# EAGLE design bonnet_floral (EAGLE 7.7.0)
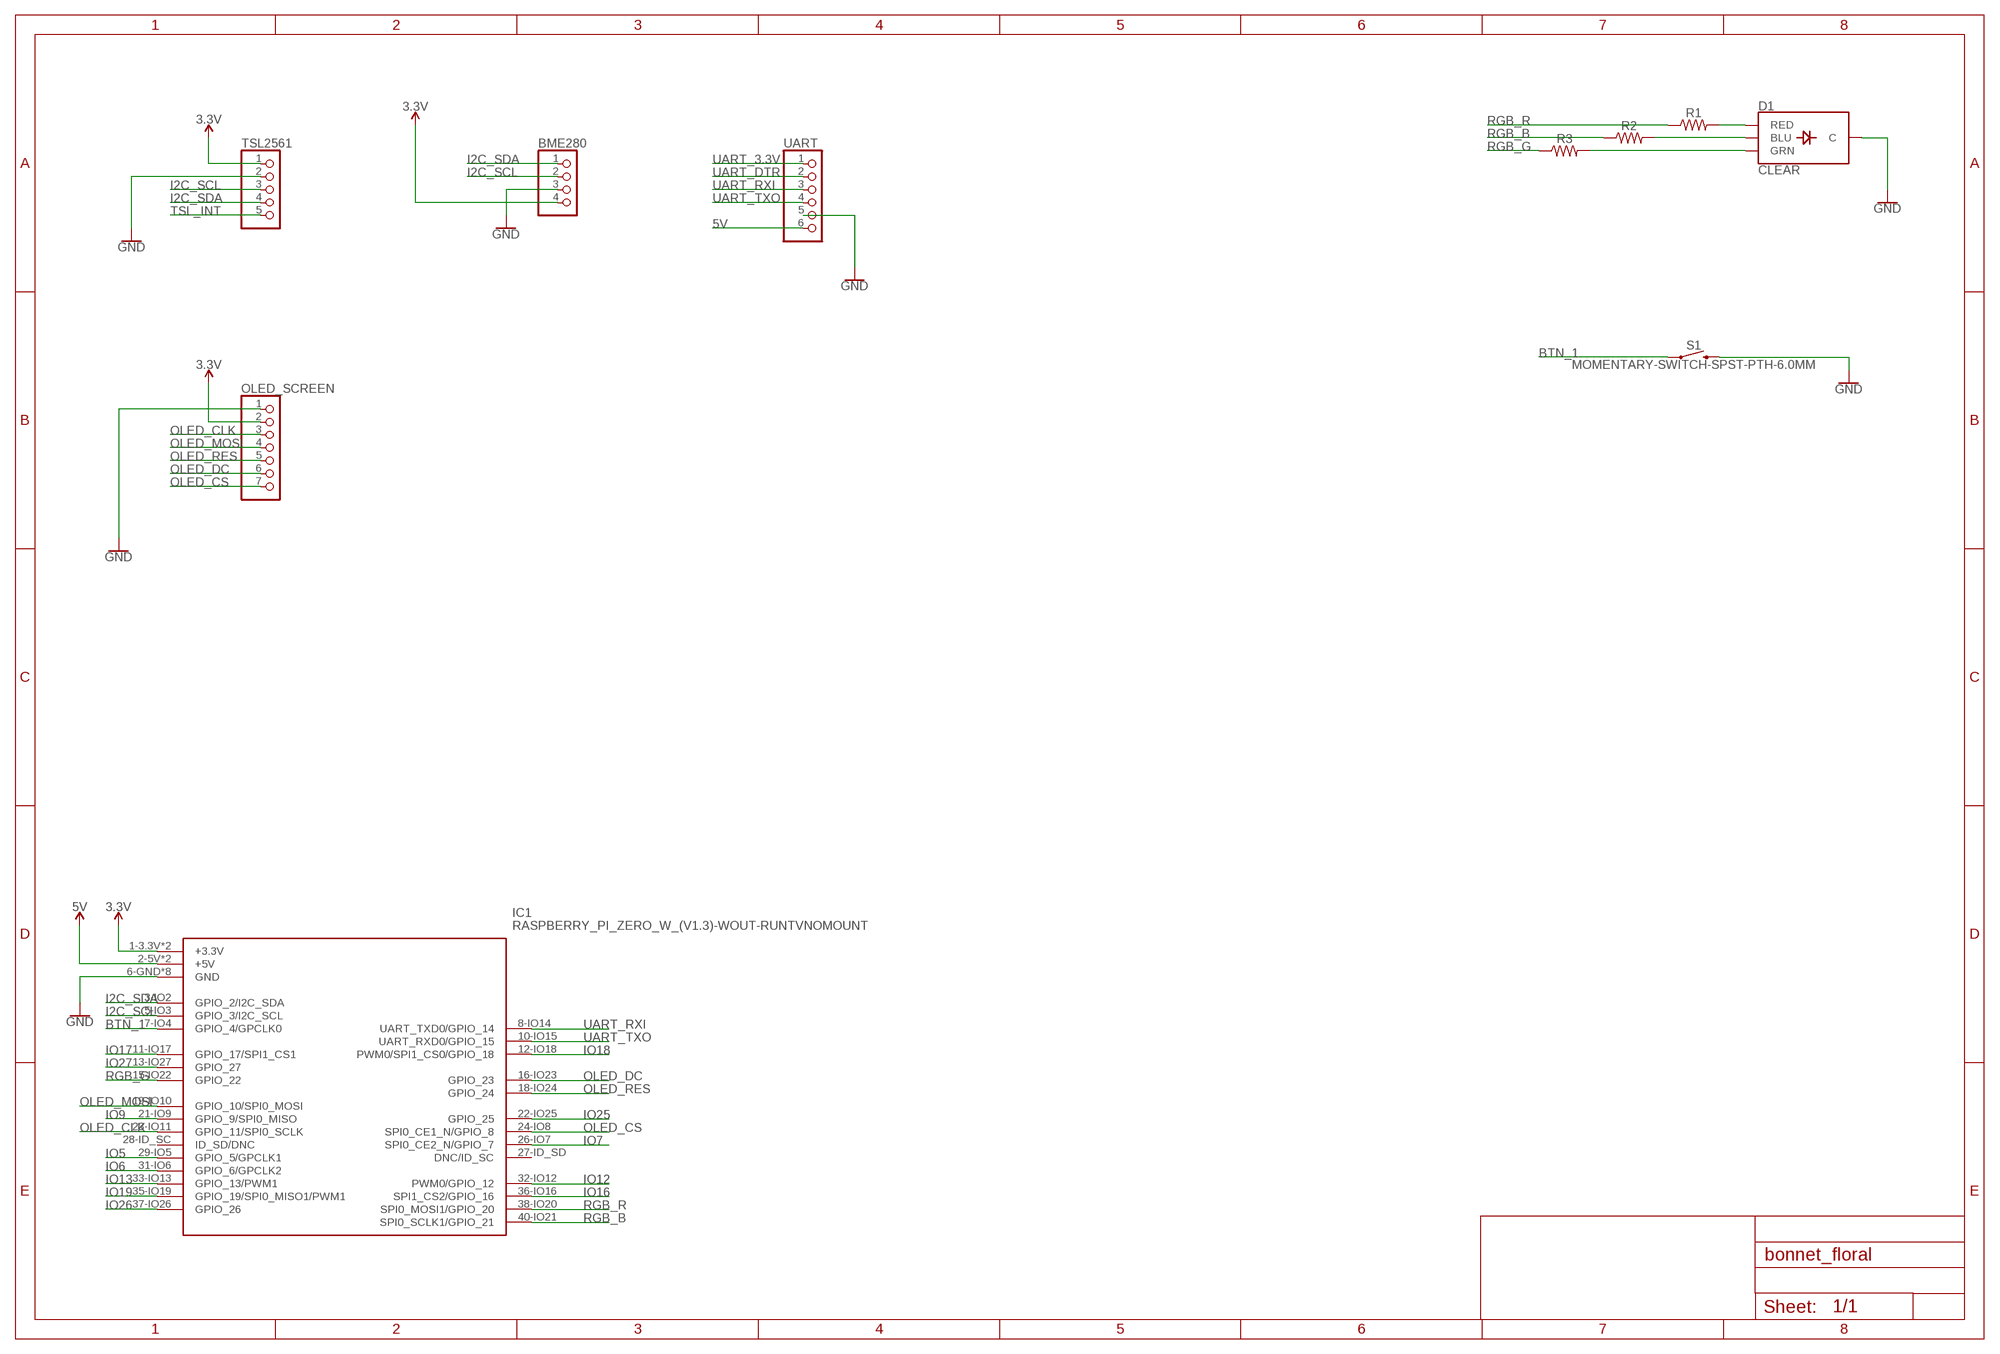
[diagram p0: schematic, sheet 1]

## Parts
BME280  PINHD-1X4  [1X04]
D1  CLEAR  LED-RGB-CCCLEAR  [LED-RGB-THRU@1]
IC1  RASPBERRY_PI_ZERO_W_(V1.3)-WOUT-RUNTVNOMOUNT  [RASPBERRYPIZEROWV13-WOUT-RUNTV-NOMOUNT]
OLED_SCREEN  PINHD-1X7  [1X07]
R1  RESISTORAXIAL-0.3  [AXIAL-0.3]
R2  RESISTORAXIAL-0.3  [AXIAL-0.3]
R3  RESISTORAXIAL-0.3  [AXIAL-0.3]
S1  MOMENTARY-SWITCH-SPST-PTH-6.0MM  [TACTILE_SWITCH_PTH_6.0MM]
TSL2561  PINHD-1X5  [1X05]
UART  PINHD-1X6  [1X06]

## Nets
3.3V: BME280.4 IC1.1-3.3V(+3.3V) IC1.17-3.3V(+3.3V) OLED_SCREEN.2 TSL2561.1
5V: IC1.2-5V(+5V) IC1.4-5V(+5V) UART.6
BTN_1: IC1.7-IO4(GPIO_4/GPCLK0) S1.1
GND: BME280.3 D1.2(C) IC1.6-GND(GND) IC1.9-GND(GND) IC1.14-GND(GND) IC1.20-GND(GND) IC1.25-GND(GND) IC1.30-GND(GND) IC1.34-GND(GND) IC1.39-GND(GND) OLED_SCREEN.1 S1.3 TSL2561.2 UART.5
I2C_SCL: BME280.2 IC1.5-IO3(GPIO_3/I2C_SCL) TSL2561.3
I2C_SDA: BME280.1 IC1.3-IO2(GPIO_2/I2C_SDA) TSL2561.4
IO5: IC1.29-IO5(GPIO_5/GPCLK1)
IO6: IC1.31-IO6(GPIO_6/GPCLK2)
IO7: IC1.26-IO7(SPI0_CE2_N/GPIO_7)
IO9: IC1.21-IO9(GPIO_9/SPI0_MISO)
IO12: IC1.32-IO12(PWM0/GPIO_12)
IO13: IC1.33-IO13(GPIO_13/PWM1)
IO16: IC1.36-IO16(SPI1_CS2/GPIO_16)
IO17: IC1.11-IO17(GPIO_17/SPI1_CS1)
IO18: IC1.12-IO18(PWM0/SPI1_CS0/GPIO_18)
IO19: IC1.35-IO19(GPIO_19/SPI0_MISO1/PWM1)
IO25: IC1.22-IO25(GPIO_25)
IO26: IC1.37-IO26(GPIO_26)
IO27: IC1.13-IO27(GPIO_27)
N$1: D1.1(RED) R1.P$2
N$2: D1.4(BLU) R2.P$2
N$3: D1.3(GRN) R3.P$2
OLED_CLK: IC1.23-IO11(GPIO_11/SPI0_SCLK) OLED_SCREEN.3
OLED_CS: IC1.24-IO8(SPI0_CE1_N/GPIO_8) OLED_SCREEN.7
OLED_DC: IC1.16-IO23(GPIO_23) OLED_SCREEN.6
OLED_MOSI: IC1.19-IO10(GPIO_10/SPI0_MOSI) OLED_SCREEN.4
OLED_RES: IC1.18-IO24(GPIO_24) OLED_SCREEN.5
RGB_B: IC1.40-IO21(SPI0_SCLK1/GPIO_21) R2.P$1
RGB_G: IC1.15-IO22(GPIO_22) R3.P$1
RGB_R: IC1.38-IO20(SPI0_MOSI1/GPIO_20) R1.P$1
TSL_INT: TSL2561.5
UART_3.3V: UART.1
UART_DTR: UART.2
UART_RXI: IC1.8-IO14(UART_TXD0/GPIO_14) UART.3
UART_TXO: IC1.10-IO15(UART_RXD0/GPIO_15) UART.4
Unconnected: IC1.27-ID_SD(DNC/ID_SC) IC1.28-ID_SC(ID_SD/DNC)

## Library data of the parts
BME280 = pinhead:PINHD-1X4: PIN HEADER
D1 = SparkFun-LED:LED-RGB-CC: LED-RGB Common Cathode Packages: LED RGB-THRU LED_PIRANHA_5MM SparkFun Products: RGB Diffused Common Cathode- Diffuse <[https://www.sparkfun.com/products/9264]> RGB Diffused Common Cathode - Clear <[https://www.sparkfun.com/products/105]> LED-RGB 5mm Square (Piranha) <[https://www.sparkfun.com/products/11679]>; PROD_ID: DIO-08418
IC1 = Raspberry_Pi_Zero_W_(v1.3):RASPBERRY_PI_ZERO_W_(V1.3)-WOUT-RUNTV: Raspberry Pi Zero W (v1.3) Single-board Computers Source: Datasheet <https://cdn.sparkfun.com/assets/learn_tutorials/6/7/6/PiZero_1.pdf>
OLED_SCREEN = pinhead:PINHD-1X7: PIN HEADER
R1-R3 = SparkFun-Resistors:RESISTOR: Generic Resistor Package
S1 = SparkFun-Switches:MOMENTARY-SWITCH-SPST: Momentary Switch (Pushbutton) - SPST Normally-open (NO) SPST momentary switches (buttons, pushbuttons). Variants PTH-12MM - 12mm square, through-hole Momentary Pushbutton Switch - 12mm Square <https://www.sparkfun.com/products/9190> (COM-09190) PTH-6.0MM, PTH-6.0MM-KIT - 6.0mm square, through-hole Mini Pushbutton Switch <https://www.sparkfun.com/products/97> (COM-00097) KIT package intended for soldering kit's - only one side of pads' copper is exposed. PTH-RIGHT-ANGLE-KIT - Right-angle, through-hole Right Angle Tactile Button <https://www.sparkfun.com/products/10791> - Used on SparkFun BigTime Watch Kit <https://www.sparkfun.com/products/11734> SMD-12MM - 12mm square, surface-mount Tactile Button - SMD (12mm) <https://www.sparkfun.com/products/12993> (COM-12993) Used on SparkFun PicoBoard <https://www.sparkfun.com/products/11888> SMD-4.5MM - 4.5mm Square Trackball Switch Used on SparkFun Blackberry Trackballer Breakout <https://www.sparkfun.com/products/13169> SMD-4.6MMX2.8MM - 4.60mm x 2.80mm, surface mount Used on SparkFun SAMD21 Mini Breakout <https://www.sparkfun.com/products/13664> SMD-5.2MM, SMD-5.2-REDUNDANT - 5.2mm square, surface-mount Mini Pushbutton Switch - SMD <https://www.sparkfun.com/products/8720> (COM-08720) Used on Arduino Pro Mini <https://www.sparkfun.com/products/11114> REDUNDANT package connects both switch circuits together SMD-6.0X3.5MM - 6.0 x 3.5mm, surface mount Momentary Reset Switch SMD <https://www.sparkfun.com/products/8229> (COM-08229) SMD-6.2MM-TALL - 6.2mm square, surface mount Tactile Button - SMD (6mm) <https://www.sparkfun.com/products/12992> Used on SparkFun Digital Sandbox <https://www.sparkfun.com/products/12651> SMD-RIGHT-ANGLE - Right-angle, surface mount Used on SparkFun Block for Intel® Edison - Arduino <https://www.sparkfun.com/products/13036>; PROD_ID: SWCH-08441; SF_SKU: COM-00097
TSL2561 = pinhead:PINHD-1X5: PIN HEADER
UART = pinhead:PINHD-1X6: PIN HEADER

## Board
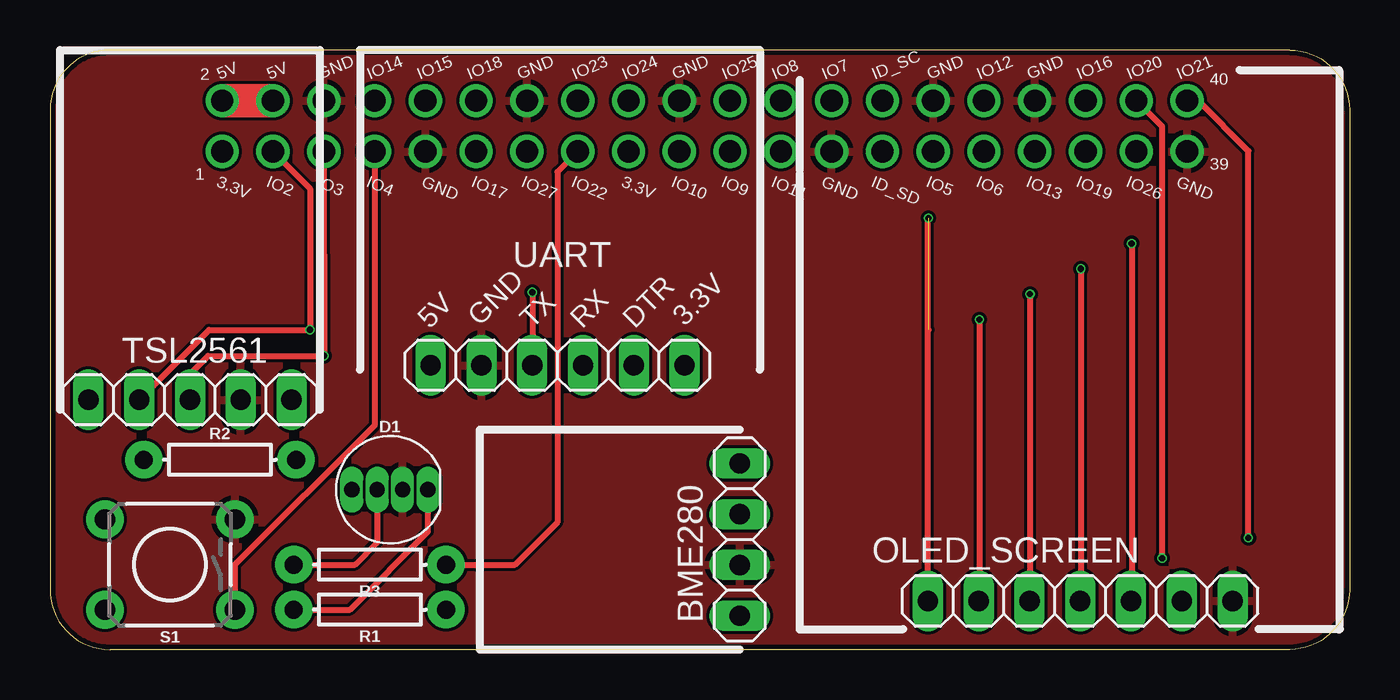
[diagram p1: board, top side]
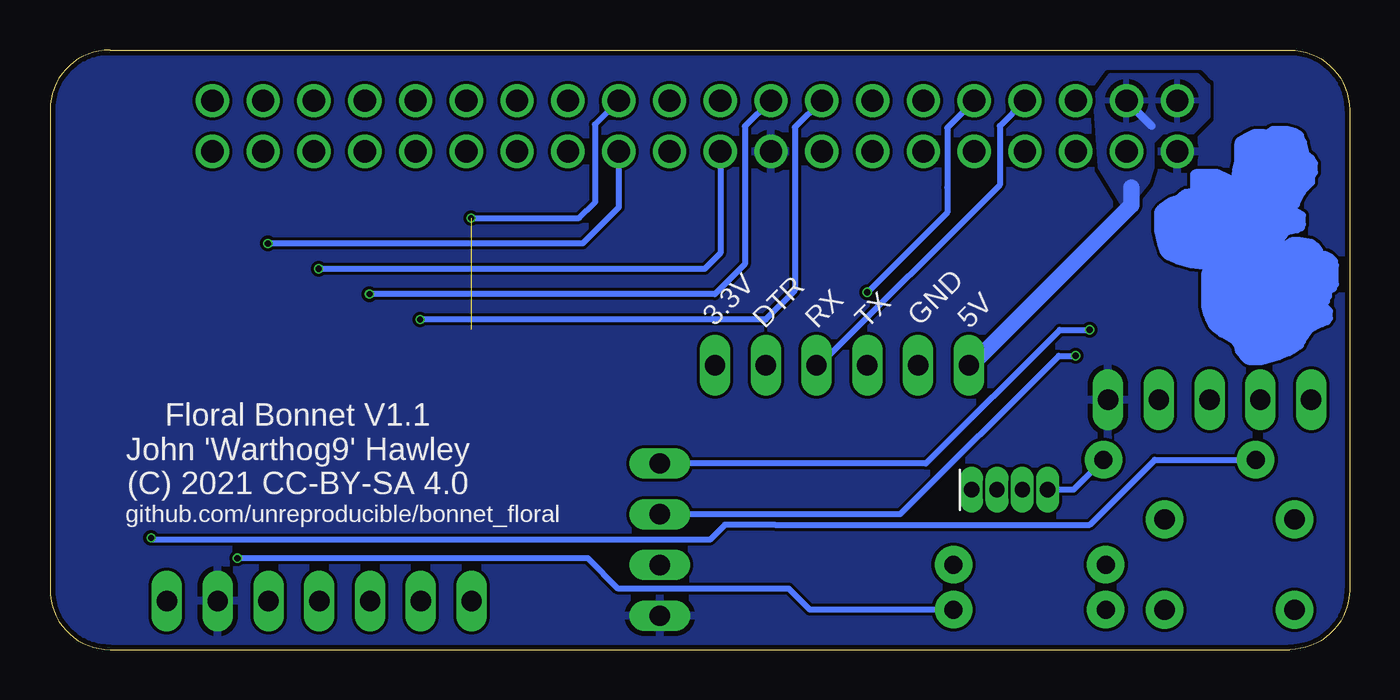
[diagram p2: board, bottom side, seen from below]

Size 65 x 30 mm. Coordinates in mm from the lower left corner, seen from the top.
Copper layers (1*16): Top 0.035mm / dielectric 1.5mm / Bottom 0.035mm
Design rules "default *": minimum track width 6mil, minimum drill 12mil, track to track 6mil, track to pad 6mil, pad to pad 6mil, via to via 6mil, smd to smd 6mil, copper to edge 10mil, drill to drill 8mil, minimum pad ring 0mil, minimum via ring 0mil, stop-mask expansion 4mil, vias tented up to drill 0mil, thermal gap 10mil

### Footprints (pad centres in the part's own frame; a part is rotated, then mirrored left to right if it is on the bottom)
1X04 = drill 1.016 long: 1 -3.81,0; 2 -1.27,0; 3 1.27,0; 4 3.81,0
LED-RGB-THRU@1 = drill 0.762 pad 0.889 long: 1 1.905,0; 2 0.635,0; 3 -0.635,0; 4 -1.905,0
RASPBERRYPIZEROWV13-WOUT-RUNTV-NOMOUNT = drill 1.11: 1-3.3V 8.615,24.92; 2-5V 8.615,27.46; 3-IO2 11.155,24.92; 4-5V 11.155,27.46; 5-IO3 13.695,24.92; 6-GND 13.695,27.46; 7-IO4 16.235,24.92; 8-IO14 16.235,27.46; 9-GND 18.775,24.92; 10-IO15 18.775,27.46; 11-IO17 21.315,24.92; 12-IO18 21.315,27.46; 13-IO27 23.855,24.92; 14-GND 23.855,27.46; 15-IO22 26.395,24.92; 16-IO23 26.395,27.46; 17-3.3V 28.935,24.92; 18-IO24 28.935,27.46; 19-IO10 31.475,24.92; 20-GND 31.475,27.46; 21-IO9 34.015,24.92; 22-IO25 34.015,27.46; 23-IO11 36.555,24.92; 24-IO8 36.555,27.46; 25-GND 39.095,24.92; 26-IO7 39.095,27.46; 27-ID_SD 41.635,24.92; 28-ID_SC 41.635,27.46; 29-IO5 44.175,24.92; 30-GND 44.175,27.46; 31-IO6 46.715,24.92; 32-IO12 46.715,27.46; 33-IO13 49.255,24.92; 34-GND 49.255,27.46; 35-IO19 51.795,24.92; 36-IO16 51.795,27.46; 37-IO26 54.335,24.92; 38-IO20 54.335,27.46; 39-GND 56.875,24.92; 40-IO21 56.875,27.46
1X07 = drill 1.016 long: 1 -7.62,0; 2 -5.08,0; 3 -2.54,0; 4 0,0; 5 2.54,0; 6 5.08,0; 7 7.62,0
AXIAL-0.3 = drill 0.9 pad 1.88: P$1 -3.81,0; P$2 3.81,0
TACTILE_SWITCH_PTH_6.0MM = drill 1.016 pad 1.88: 1 -3.251,2.261; 2 3.251,2.261; 3 -3.251,-2.261; 4 3.251,-2.261
1X05 = drill 1.016 long: 1 -5.08,0; 2 -2.54,0; 3 0,0; 4 2.54,0; 5 5.08,0
1X06 = drill 1.016 long: 1 -6.35,0; 2 -3.81,0; 3 -1.27,0; 4 1.27,0; 5 3.81,0; 6 6.35,0

### Placement (x,y rotation side)
BME280  34.5,5.5 270 top
D1  17,8 0 top
IC1  0,0 0 top
OLED_SCREEN  51.53,2.43 180 top
R1  16,2 180 top
R2  8.5,9.5 0 top
R3  16,4.25 180 top
S1  6,4.25 180 top
TSL2561  7,12.5 180 top
U$1  [FLORAL_SMALLER_MIRROR]  5.13,20.23 0 bottom
UART  25.39,14.22 180 top

### Tracks (layer width: path | path; a pad name or v marks a point on that pad's centre or on a via)
3.3V
  pour Bottom (rank 6): -1,-1 -1,31 66,31 66,-1
5V
  Top 1.676: IC1.2-5V IC1.4-5V
  Bottom 0.406: IC1.4-5V 9.91,26.21 | 18.93,14.22 UART.6
  Bottom 0.813: 18.93,14.22 10.92,22.23 10.92,23.11
  pour Bottom: 11.94,28.7 7.62,28.7 7.11,28.19 7.11,26.67 7.87,25.91 9.4,25.91 9.91,25.4 9.91,24.13 10.16,23.37 11.18,22.1 12.45,24.13 12.7,27.69
BTN_1
  Top 0.3: S1.1 9.25,4.25 16.25,11.25 16.25,24.66 IC1.7-IO4
GND
  pour Top: 0,0 65.06,0 65,30 0,30
I2C_SCL  (via drill 0.3)
  Top 0.305: IC1.5-IO3 v13.7,14.7 7.9,14.7 7,13.8 TSL2561.3
  Bottom 0.305: BME280.2 22.48,6.77 14.55,14.7 v13.7,14.7
I2C_SDA  (via drill 0.3)
  Top 0.305: IC1.3-IO2 13,23.07 v13,16 7.96,16 TSL2561.4
  Bottom 0.305: BME280.1 21.19,9.31 14.5,16 v13,16
N$1
  Top 0.3: R1.P$2 15,2 18.91,5.91 D1.1
N$2
  Bottom 0.3: R2.P$2 13.81,8 D1.4
N$3
  Top 0.3: D1.3 16.36,5.37 15.25,4.25 R3.P$2
OLED_CLK  (via drill 0.3)
  Top 0.3: v54.1,20.32 54.1,2.46 OLED_SCREEN.3
  Bottom 0.3: IC1.23-IO11 36.55,22.12 38.35,20.32 v54.1,20.32
OLED_CS  (via drill 0.3)  (1 unrouted)
  Top 0.3: 43.91,15.97 43.94,16 | OLED_SCREEN.7 43.91,21.59 v43.94,21.59
  Bottom 0.3: IC1.24-IO8 37.75,26.27 37.75,22.37 38.53,21.59 v43.94,21.59
OLED_DC  (via drill 0.3)
  Top 0.3: v46.48,16.51 46.48,2.46 OLED_SCREEN.6
  Bottom 0.3: IC1.16-IO23 27.75,26.14 27.75,17.97 29.21,16.51 v46.48,16.51
OLED_MOSI  (via drill 0.3)
  Top 0.3: v51.56,19.05 51.56,2.46 OLED_SCREEN.4
  Bottom 0.3: IC1.19-IO10 31.48,19.83 32.26,19.05 v51.56,19.05
OLED_RES  (via drill 0.3)
  Top 0.3: v49.02,17.78 49.02,2.46 OLED_SCREEN.5
  Bottom 0.3: IC1.18-IO24 30.25,26.18 30.25,19.28 31.75,17.78 v49.02,17.78
RGB_B  (via drill 0.3)
  Top 0.3: v59.94,5.59 59.94,24.94 57.43,27.46 IC1.40-IO21
  Bottom 0.3: 28.75,6.25 13,6.25 9.75,9.5 R2.P$1 | 36.5,5.5 59.86,5.5 v59.94,5.59
  Bottom 0.305: 28.75,6.25 31.25,6.25 32,5.5 36.5,5.5
RGB_G
  Top 0.3: R3.P$1 23.25,4.25 25.38,6.38 25.38,23.9 IC1.15-IO22
RGB_R  (via drill 0.3)
  Top 0.3: IC1.38-IO20 55.62,26.17 v55.62,4.57 v55.63,4.57
  Bottom 0.3: 28,3 28.05,3.05 36.58,3.05 38.1,4.57 v55.63,4.57
  Bottom 0.305: R1.P$1 27,2 28,3
UART_RXI
  Bottom 0.3: IC1.8-IO14 17.5,26.2 17.5,23.25
  Bottom 0.305: 17.5,23.25 26.53,14.22 UART.3
UART_TXO  (via drill 0.3)
  Top 0.305: v24.12,17.88 UART.4
  Bottom 0.3: IC1.10-IO15 20.12,26.11 20.12,23.12
  Bottom 0.305: 20.12,23.12 20.12,21.88 v24.12,17.88

### Text on the board
tPlace: 5V | GND | TX | RX | DTR | 3.3V
bPlace: 5V | GND | TX | RX | DTR | 3.3V | Floral Bonnet V1.1 / John 'Warthog9' Hawley / (C) 2021 CC-BY-SA 4.0 | github.com/unreproducible/bonnet_floral